# Altium schematic sheet ACC_charger.SchDoc
size A4
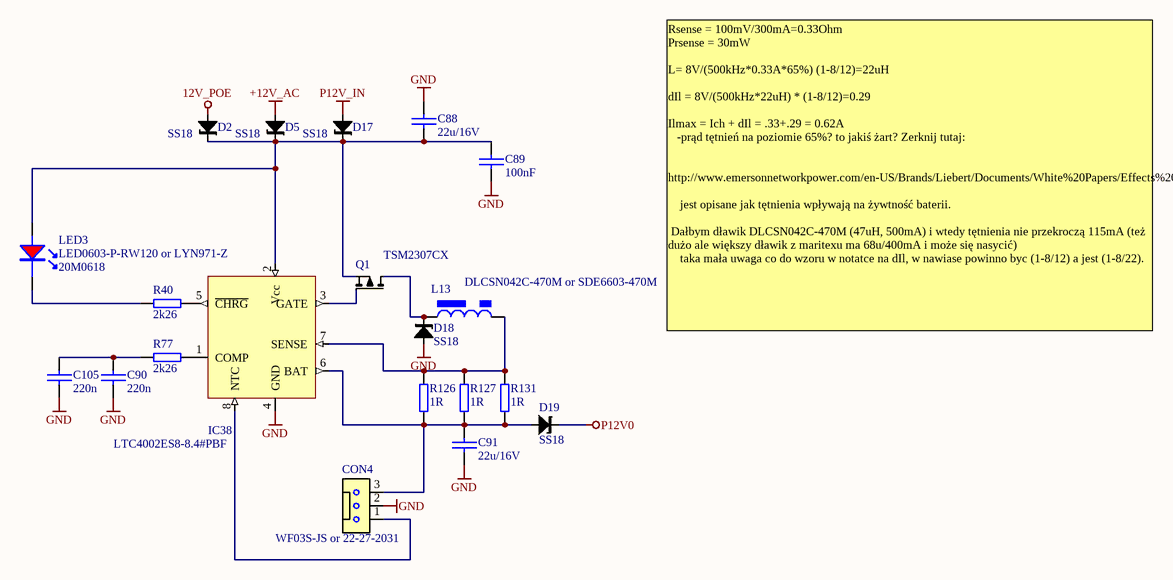
[diagram p0: ACC_charger.SchDoc]

## Parts
C88  22u/16V  [1206C]
C89  100nF  [0402C]
C90  220n  [0603C]
C91  22u/16V  [1206C]
C105  220n  [0603C]
CON4  WF03S-JS or 22-27-2031  [CON_WF03S-LF]
D2  SS18  [DO-214AC/SMA]
D5  SS18  [DO-214AC/SMA]
D17  SS18  [DO-214AC/SMA]
D18  SS18  [DO-214AC/SMA]
D19  SS18  [DO-214AC/SMA]
IC38  LTC4002ES8-8.4#PBF  [SO-8]
L13  DLCSN042C-470M or SDE6603-470M  [L_DLCSN042C]
LED3  LED0603-P-RW120 or LYN971-Z  Supplier Part Number 2: 20M0618  [led_0603R]
Q1  TSM2307CX  [sot-23]
R40  2k26  [0603R]
R77  2k26  [0603R]
R126  1R  [0603R]
R127  1R  [0603R]
R131  1R  [0603R]

## Nets
12V_POE: D2.A
+12V_AC: D5.A
GND: C88.1 C89.2 C90.2 C91.2 C105.2 CON4.2 D18.A IC38.4(GND)
P12V0: D19.K
P12V_IN: D17.A
NetC88_2: C88.2 C89.1 D2.K D5.K D17.K IC38.2(Vcc) LED3.A Q1.2(S)
NetC90_1: C90.1 C105.1 R77.1
NetC91_1: C91.1 CON4.3 D19.A IC38.6(BAT) R126.1 R127.1 R131.1
NetCON4_1: CON4.1 IC38.8(NTC)
NetD18_K: D18.K L13.1 Q1.3(D)
NetIC38_1: IC38.1(COMP) R77.2
NetIC38_3: IC38.3(GATE) Q1.1(G)
NetIC38_5: IC38.5(~{CHRG}) R40.2
NetIC38_7: IC38.7(SENSE) L13.2 R126.2 R127.2 R131.2
NetLED3_K: LED3.K R40.1

## Notes on the sheet
- Rsense = 100mV/300mA=0.33Ohm
  Prsense = 30mW
  L= 8V/(500kHz*0.33A*65%) (1-8/12)=22uH
  dIl = 8V/(500kHz*22uH) * (1-8/12)=0.29
  Ilmax = Ich + dIl = .33+.29 = 0.62A
  -prąd tętnień na poziomie 65%? to jakiś żart? Zerknij tutaj:
  http://www.emersonnetworkpower.com/en-US/Brands/Liebert/Documents/White%20Papers/Effects%20of%20AC%20Ripple%20Current%20on%20VRLA%20Battery%20Life.pdf
  jest opisane jak tętnienia wpływają na żywtność baterii.
  Dałbym dławik DLCSN042C-470M (47uH, 500mA) i wtedy tętnienia nie przekroczą 115mA (też dużo ale większy dławik z maritexu ma 68u/400mA i może się nasycić)
  taka mała uwaga co do wzoru w notatce na dIl, w nawiase powinno byc (1-8/12) a jest (1-8/22).

## Library data of the parts
C88 C91 = CAP_SMD_1206: Capacitor SMD; Supplier 1: Newark; Supplier Part Number 1: 90R7810
C89 = CAP_SMD_0402: Capacitor SMD; Supplier 1: Newark; Supplier Part Number 1: 14T3275
C90 C105 = CAP_SMD_0603: Capacitor SMD
CON4 = CON_3_2.54_key: 2.54mm crimped terminal header; Supplier 1: Newark; Supplier Part Number 1: 13T6895
D2 D5 D17-D19 = shottky_SS14_18: shottky diode (Maritex)
IC38 = PM_LTC4002ES8-8.4: Standalone Li-Ion  Switch Mode Battery Charger; Supplier 1: Newark; Supplier Part Number 1: 58M0818
L13 = L_POWER_DLCSN042C_47uH: 47uH, 0.5A, 0.64R, inductor (Maritex); Supplier 1: Newark; Supplier Part Number 1: 74R9579
LED3 = LED_0603R: LED 0603 red; Supplier 1: Newark; Supplier Part Number 1: 22M3004; Supplier 2: Newark
Q1 = Q_TSM2307CX: P MOSFET 30V, 0.14R, 2A; Supplier 1: Newark; Supplier Part Number 1: 27T2994
R40 R77 R126 R127 R131 = RES_0603: SMD Resistor; Supplier 1: Newark; Supplier Part Number 1: 39K0073